# Altium schematic sheet [6]TS.SchDoc
size A4; SheetNumber: 2; SheetTotal: 2
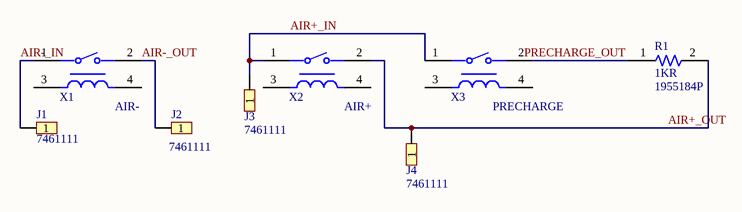
[diagram p0: [6]TS.SchDoc]

## Parts
J1  7461111  [J_Power_Connector_180A]
J2  7461111  [J_Power_Connector_180A]
J3  7461111  [J_Power_Connector_180A]
J4  7461111  [J_Power_Connector_180A]
R1  Resistance: 1KR  Supplier Part Number 1: 1955184P  [RTO247]  (hidden comment: R470-TO247)
X1  AIR-  [RELAY_LEV100H]
X2  AIR+  [RELAY_LEV100H]
X3  PRECHARGE  [RELAY_LEV100H]

## Nets
AIR+_IN: J3.1 X2.1 X3.1
AIR+_OUT: J4.1 R1.2 X2.2
AIR-_IN: J1.1 X1.1
AIR-_OUT: J2.1 X1.2
PRECHARGE_OUT: R1.1 X3.2

Not connected (* = marked no-connect by the designer): X1 3 4; X2 3 4; X3 3 4

## Library data of the parts
J1-J4 = J_Power_Connector_180A
R1 = R1K-TO247: Res, 1K, 100W, To-247, Thick Film Rohs Compliant: Yes |Cgs Te Connectivity MPT100C1K0F; Manufacturer Part Number: MPT100C470RF; Operating Supply Voltage: 700V; Value: 1kR; Manufacturer: TE Connectivity; RoHS: No; Stock 1: 67; Pricing 1: 1=16,67000, 5=15,51000, 10=14,17000, 25=12,67000, 50=11,50000 (GBP); ComponentLink1Description: Buy; ComponentLink1URL: https://es.rs-online.com/web/p/resistencias-de-montaje-en-orificio-pasante/1955176; ComponentLink2Description: Datasheet; ComponentLink2URL: https://docs.rs-online.com/e31c/A700000006565355.pdf; Category: Through-Hole Resistors; Stock 2: 28; Pricing 2: 5=23,84, 10=21,8, 25=19,49, 50=17,69 (EUR); Power Rating: 100W; ComponentLink3URL: https://datasheet.octopart.com/MPT100C1K0F-TE-Connectivity-datasheet-136791881.pdf?src-supplier=TE+Connectivity; ComponentLink3Description: https://datasheet.octopart.com/MPT100C1K0F-TE-Connectivity-datasheet-136791881.pdf?src-supplier=TE+Connectivity; Supplier 1: Rs
X1-X3 = Relay_LEV100H: Electromechanical Relay 12VDC 26Ohm 100A SPST-NO-DM(57.96x40.77)mm Chassis Contactor Relay; Manufacturer: Cynergy3; Manufacturer Part Number: DAR72410FU; Coil Current: 30.7mA; Throw Configuration: SPST; Operate Time: 3ms; Release Time: 2ms; Coil Resistance: 780R; Relay Type: Reed; Coil Type: Non-Latching; Coil Voltage (DC): 24V; Contact Current Rating: 3A; Supplier 1: Newark; RoHS: No; Category: Power Relays; Mount: Through Hole; Min Operating Temperature: -20°C; Max Operating Temperature: 70°C; Packaging: Bulk; Termination: Wire Leads; REACH SVHC: No SVHC; RoHS Compliant: No; ComponentLink1URL: http://www.cynergy3.com/sites/default/files/DA%28UL%29%20series%202016.pdf?src-supplier=Digi-Key; ComponentLink1Description: http://www.cynergy3.com/sites/default/files/DA%28UL%29%20series%202016.pdf?src-supplier=Digi-Key; ComponentLink2URL: http://www.farnell.com/datasheets/2145120.pdf?src-supplier=Element14; ComponentLink2Description: http://www.farnell.com/datasheets/2145120.pdf?src-supplier=Element14; Supplier Part Number 1: 98Y7538; Supplier 2: Digi-Key; Stock 2: 114; Pricing 2: 1=160,97, 10=151,5, 25=142,0312, 50=132,5624 (USD); ComponentLink3URL: https://datasheet.ciiva.com/2407/eng-ds-6-1773450-9-lev100-0908-2407297.pdf?src-supplier=Digi-Key; ComponentLink3Description: https://datasheet.ciiva.com/2407/eng-ds-6-1773450-9-lev100-0908-2407297.pdf?src-supplier=Digi-Key; ComponentLink4URL: https://datasheet.ciiva.com/31835/prt4038-31835873.pdf?src-supplier=Onlinecomponents.com; ComponentLink4Description: https://datasheet.ciiva.com/31835/prt4038-31835873.pdf?src-supplier=Onlinecomponents.com; Supplier Part Number 2: A101167-ND